# Altium project Booster_USER_IFC_W5500.PrjPcb
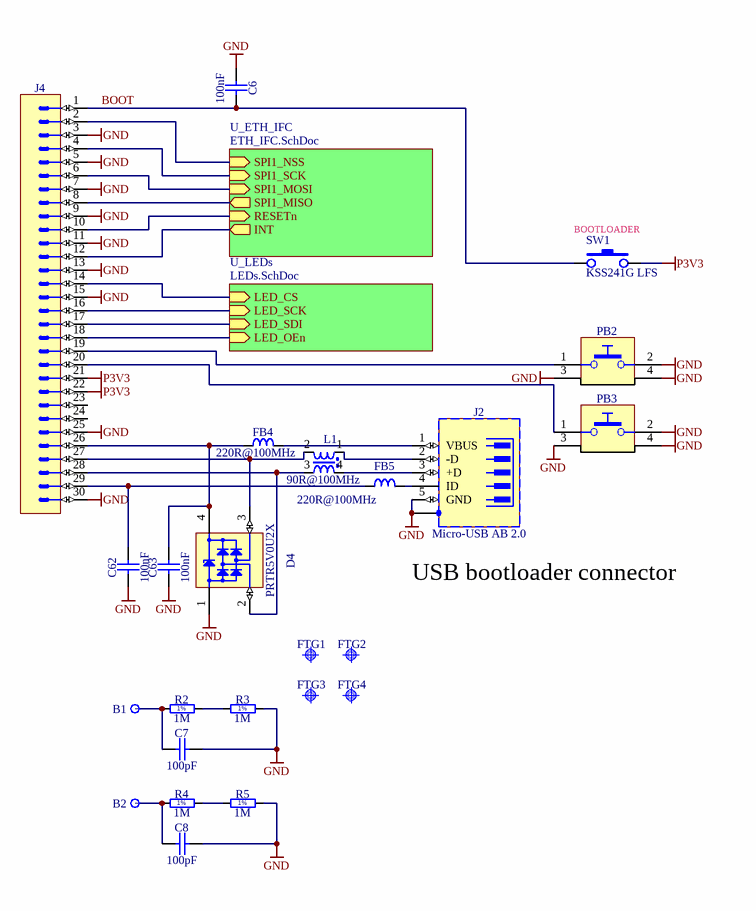
[diagram p0: Booster_USER_IFC_W5500.SchDoc]
rev: 1.6.2
3 sheets, 87 parts. Net scope: hierarchical (ports join the sheet entries above them; power ports are global).
Board file: Booster_USER_IFC_W5500.PcbDoc
Sheets:
  Booster_USER_IFC_W5500.SchDoc
    U_ETH_IFC = ETH_IFC.SchDoc
    U_LEDs = LEDs.SchDoc

## Sheet Booster_USER_IFC_W5500.SchDoc: Booster User Interface
size 420 x 297 mm; Author: G.K.; CompanyName: WUT; DrawnBy: G.K.; Organization: WUT ISE; Address1: Warsaw Univeristy of Technology; Address2: Nowowiejska 15/19; DocumentNumber: 1; Revision: 1.6.2; SheetNumber: 1; SheetTotal: 3; EDA_Number: ARTIQ; Projet: Booster RF Power Amplifier; ModifiedBy: -; CreateDate: XX/XX/XXXX; CheckedDate: -; Title2: TOP; DivGrp: ISE; Designer: G.K.; ModifiedDate: -; ProjectName: Booster RF Power Amplifier

### Parts
B1  Plated Hole  [MTG320_550]  (value not drawn)  (no BOM)
B2  Plated Hole  [MTG320_550]  (value not drawn)  (no BOM)
C6  100nF  [CAPC1005X55N]
C7  100pF  [CAPC2012X88N]
C8  100pF  [CAPC2012X88N]
C62  100nF  [CAPC1005X55N]
C63  100nF  [CAPC1005X55N]
D4  PRTR5V0U2X  [SOT190P230X110-4N]
FB4  220R@100MHz  [INDC2012X105N]
FB5  220R@100MHz  [INDC2012X105N]
FTG1  Use only in PCB  [FIDUCIAL_TOP_C100-200]  (value not drawn)
FTG2  Use only in PCB  [FIDUCIAL_TOP_C100-200]  (value not drawn)
FTG3  Use only in PCB  [FIDUCIAL_TOP_S100-200]  (value not drawn)
FTG4  Use only in PCB  [FIDUCIAL_TOP_S100-200]  (value not drawn)
J2  Micro-USB AB 2.0  [HIROSE_ZX62RD-AB-5P8]
J4  (no value)  [3M_N2530-6002RB]
L1  90R@100MHz  [IND_MURATA_DLW21S]
PB2  Push Button  [PB_TYCO_1-1825027-1]  (value not drawn)
PB3  Push Button  [PB_TYCO_1-1825027-1]  (value not drawn)
R2  1M  [RESC1005X40N]
R3  1M  [RESC1005X40N]
R4  1M  [RESC1005X40N]
R5  1M  [RESC1005X40N]
SW1  KSS241G LFS  [KSS241G LFS]

### Sub-sheets
U_ETH_IFC = ETH_IFC.SchDoc: SPI1_NSS (in), SPI1_SCK (in), SPI1_MOSI (in), SPI1_MISO (out), INT (out), RESETn (in)
U_LEDs = LEDs.SchDoc: LED_CS (in), LED_SCK (in), LED_SDI (in), LED_OEn (in)

### Nets
GND: C6.1 C7.2 C8.2 C62.1 C63.1 D4.1(GND) J2.5(GND) J2.6(SH) J4.3 J4.5 J4.7 J4.9 J4.11 J4.13 J4.15 J4.25 J4.30 PB2.2 PB2.3 PB2.4 PB3.2 PB3.3 PB3.4 R3.2 R5.2
P3V3: J4.21 J4.22 SW1.2
BOOT: C6.2 J4.1 SW1.1
INT: J4.12 ; sheet U_ETH_IFC/INT
LED_CS: J4.14 ; sheet U_LEDs/LED_CS
LED_OEn: J4.18 ; sheet U_LEDs/LED_OEn
LED_SCK: J4.16 ; sheet U_LEDs/LED_SCK
LED_SDI: J4.17 ; sheet U_LEDs/LED_SDI
RESETn: J4.10 ; sheet U_ETH_IFC/RESETn
SPI1_MISO: J4.8 ; sheet U_ETH_IFC/SPI1_MISO
SPI1_MOSI: J4.6 ; sheet U_ETH_IFC/SPI1_MOSI
SPI1_NSS: J4.2 ; sheet U_ETH_IFC/SPI1_NSS
SPI1_SCK: J4.4 ; sheet U_ETH_IFC/SPI1_SCK
NetB1_1: B1.1 C7.1 R2.1
NetB2_1: B2.1 C8.1 R4.1
NetC62_2: C62.2 FB5.1 J4.29
NetC63_2: C63.2 D4.4(VCC) FB4.1 J4.26
NetD4_2: D4.2(I/O1) J4.28 L1.3
NetD4_3: D4.3(I/O2) J4.27 L1.2
NetFB4_2: FB4.2 J2.1(VBUS)
NetFB5_2: FB5.2 J2.4(ID)
NetJ2_2: J2.2(-D) L1.1
NetJ2_3: J2.3(+D) L1.4
NetJ4_19: J4.19 PB2.1
NetJ4_20: J4.20 PB3.1
NetR2_2: R2.2 R3.1
NetR4_2: R4.2 R5.1

Not connected (* = marked no-connect by the designer): J4 23 24

### Notes on the sheet
- (near SW1) BOOTLOADER
- (near J2) USB bootloader connector
- Project/Equipment
- Document
- Designer
- Drawn by
- Check.by
- File
- Last Mod.
- Print Date
- Sheet
- Size
- A3
- of
- Rev
- (in symbol R0402_1M_1%_0.0625W_100PPM) 1%

### Library data of the parts
B1 B2 = PLATED_HOLE3.2_PAD5.5: Single Terminal Socket; Part Description: Plated Through Hole: Hole Dia.=3.2mm Pad Dia.=5.5mm; Mounted: No; Part Number: PLATED_HOLE3.2_PAD5.5; Component Type: Standard (No BOM); Pin Count: 1; Family: Plated Hole; Socket: No; SMD: No; Sense: No; Status: None; ComponentHeight: 0mm; HelpURL: Undefined; Author: CERN DEM JMW; CreateDate: 01.10.2012; LatestRevisionDate: 01.10.2012; PackageDescription: Plated Through Hole: Hole Dia.=3.2mm Pad Dia.=5.5mm
C6 C62 C63 = CC0402_100NF_16V_10%_X7R: Non-polarised capacitor; Part Description: SMD Multilayer Chip Ceramic Capacitor; Manufacturer: GENERIC; Manufacturer1 Part Number: GRM155R71C104KA88D; Voltage: 16V; TC: X7R; Tolerance: ±10%; Part Number: CC0402_100NF_16V_10%_X7R; Component Kind: Standard; Component Type: Standard; Pin Count: 2; Value: 100nF; Status: Not Recommended; Manufacturer Part Number: CC0402_100NF_16V_10%_X7R; Case: 0402; Mounted: Yes; Socket: No; SMD: Yes; Manufacturer1 Example: MURATA; Manufacturer1 ComponentHeight: 0.55mm; HelpURL: \\cern.ch\dfs\Applications\Altium\Datasheets\CC0402_X7R_MURATA_GRM.pdf; Author: CERN DEM JLC; CreateDate: 05.12.2013; LatestRevisionDate: 03.12.2007; Sense: No
C7 C8 = CC0805_100PF_200V_5%_C0G: Non-polarised capacitor; Part Description: SMD Multilayer Chip Ceramic Capacitor; Manufacturer: GENERIC; Manufacturer1 Part Number: C0805C101J2GACTU; Voltage: 200V; TC: C0G/NP0; Tolerance: ±5%; Part Number: CC0805_100PF_200V_5%_C0G; Component Kind: Standard; Component Type: Standard; Pin Count: 2; Value: 100pF; Status: Preferred; Manufacturer Part Number: CC0805_100PF_200V_5%_C0G; Case: 0805; Mounted: Yes; Socket: No; SMD: Yes; Sense: No; Manufacturer1 Example: KEMET; Manufacturer1 ComponentHeight: 0.88mm; HelpURL: \\cern.ch\dfs\Applications\Altium\Datasheets\CC0805_C0G_KEMET_(Commercial Grade).pdf; Author: CERN DEM JLC; CreateDate: 23.09.2014; LatestRevisionDate: 23.09.2014
D4 = PRTR5V0U2X: Ultra Low Capacitance Double Rail-to-Rail ESD Protection Diode; Part Description: Ultra Low Capacitance (1pF) Double Rail-to-Rail ESD Protection Diode (8kV); Manufacturer: NXP SEMICONDUCTORS; Voltage: 5.5V; PressFit: No; Bonding: No; Part Number: PRTR5V0U2X; Component Kind: Standard; Component Type: Standard; Device: PRTR5V0U2X; PackageDescription: SOT143B, SOT, 1.90mm Pitch; 4 Pin, 1.30mm W X 2.90mm L X 1.10mm H body, IPC Medium Density; Manufacturer Part Number: PRTR5V0U2X; Pin Count: 4; Case: SOT143B; Mounted: Yes; Socket: No; SMD: Yes; Sense: No; ComponentHeight: 1.1mm; HelpURL: \\cern.ch\dfs\Applications\Altium\Datasheets\PRTR5V0U2X.pdf; Author: CERN DEM JLC; CreateDate: 22.03.2011; LatestRevisionDate: 22.03.2011
FB4 FB5 = IND0805_MURATA_BLM21PG221SN1D: Inductor; Part Description: SMD EMIFIL Suppression Chip Ferrite Bead; Manufacturer: MURATA; Power: 2A; Resistance: 0.05R; Tolerance: ±25%; Table: Inductors SMD; Part Number: IND0805_MURATA_BLM21PG221SN1D; Component Kind: Standard; Component Type: Standard; Pin Count: 2; Value: 220R@100MHz; Status: None; Manufacturer Part Number: BLM21PG221SN1D; Case: 0805; Mounted: Yes; Socket: No; SMD: Yes; ComponentHeight: 1.05mm; HelpURL: \\cern.ch\dfs\Applications\Altium\Datasheets\IND0402_MURATA_BLM21P.pdf; Author: CERN DEM JLC; CreateDate: 2010-01-25; LatestRevisionDate: 2010-01-25
FTG1 FTG2 = FIDUCIAL_TARGET_C100-200: Fiducial Target; Part Description: Round Fiducial Target, Top Layer, 1.0mm, Top Solder 2.0mm, Keepout =2.0mm; Mounted: No; Part Number: FIDUCIAL_TARGET_C100-200; Component Kind: Standard (No BOM); Component Type: Standard (No BOM); Pin Count: 1; Family: Fiducial; Socket: No; SMD: Yes; Sense: No; Status: None; ComponentHeight: 0mm; HelpURL: Undefined; Author: CERN DEM JLC; CreateDate: 09.02.2010; LatestRevisionDate: 04.04.2012; PackageDescription: Round Fiducial Target, Top Layer, 1.0mm, Top Solder 2.0mm, Keepout =2.0mm
FTG3 FTG4 = FIDUCIAL_TARGET_S100-200: Fiducial Target; Part Description: Square Fiducial Target, Top Layer, 1.0mm, Top Solder 2.0mm, Keepout =2.0mm; Mounted: No; Part Number: FIDUCIAL_TARGET_S100-200; Component Kind: Standard (No BOM); Component Type: Standard (No BOM); Pin Count: 1; Family: Fiducial; Socket: No; SMD: Yes; Sense: No; Status: None; ComponentHeight: 0mm; HelpURL: Undefined; Author: CERN DEM JLC; CreateDate: 09.02.2010; LatestRevisionDate: 04.04.2012; PackageDescription: Square Fiducial Target, Top Layer, 1.0mm, Top Solder 2.0mm, Keepout =2.0mm
J2 = HIROSE_ZX62RD-AB-5P8: 5 Pin + 1 Shield USB Receptacle; Part Description: Micro-USB 2.0 Right Angle, SMD Type AB - Reverse (Top mount), Shell Through Hole; Manufacturer: HIROSE (HRS); PressFit: No; Part Number: HIROSE_ZX62RD-AB-5P8; Component Kind: Standard; Component Type: Standard; Pin Count: 7; Family: Micro-USB AB 2.0; Mounted: Yes; Socket: No; SMD: Yes; Sense: No; Status: None; Manufacturer Part Number: ZX62RD-AB-5P8; ComponentHeight: 2.35mm; HelpURL: \\cern.ch\dfs\Applications\Altium\Datasheets\HIROSE_ZX62RD-AB-5P8.pdf; ComponentLink1URL: \\cern.ch\dfs\Applications\Altium\Datasheets\HIROSE_ZX62RD-AB-5P8_Package-Drawing.pdf; ComponentLink1Description: Package-Drawing; Author: CERN DEM JLC; CreateDate: 29.10.2014; LatestRevisionDate: 29.10.2014
J4 = 3M_N2530-6002RB: Connector 30 Male; Part Description: 30 Contacts - Straight .100'' x .100'' Low Profile Four-Wall Header, 2500 Series; Manufacturer: 3M; PressFit: No; Part Number: 3M_N2530-6002RB; Component Kind: Standard; Component Type: Standard; Pin Count: 30; Family: Header 30; Mounted: Yes; Socket: No; SMD: No; Sense: No; Status: None; Manufacturer Part Number: N2530-6002RB; ComponentHeight: 10.03mm; HelpURL: \\cern.ch\dfs\Applications\Altium\Datasheets\3M_N2530-6002RB.pdf; Author: CERN DEM JLC; CreateDate: 11.02.2009; LatestRevisionDate: 11.08.2009
L1 = IND_MURATA_DLW21SN900SQ2L: Inductor Common Mode; Part Description: Wire Wound Common Mode Choke Coil (DLW21S Series); Manufacturer: MURATA; Power: 330mA; Resistance: 0.35R; Tolerance: ±25%; Part Number: IND_MURATA_DLW21SN900SQ2L; Component Kind: Standard; Component Type: Standard; Pin Count: 4; Value: 90R@100MHz; Status: None; Manufacturer Part Number: DLW21SN900SQ2L; Case: 0805; Mounted: Yes; Socket: No; SMD: Yes; Sense: No; ComponentHeight: 1.4mm; HelpURL: \\cern.ch\dfs\Applications\Altium\Datasheets\IND_MURATA_DLW21S.pdf; Author: CERN DEM JLC; CreateDate: 01.07.2014; LatestRevisionDate: 01.07.2014
PB2 PB3 = PB_TYCO_1-1825027-1: Push-Button Switch SPDT; Part Description: Right Angle Micro Miniature Tactile Pushbutton Switch, Round Actuator Length = 5.74mm, FSMRAJ Serie; Manufacturer: TYCO ELECTRONICS; PressFit: No; Part Number: PB_TYCO_1-1825027-1; Component Kind: Standard; Component Type: Standard; Pin Count: 4; PackageDescription: Right Angle Micro Miniature Tactile Pushbutton Switch, Round Actuator Length = 5.74mm, FSMRAJ Serie; Family: Push Button; Mounted: Yes; Socket: No; SMD: No; Sense: No; Status: None; Manufacturer Part Number: 1-1825027-1; ComponentHeight: 7.01mm; HelpURL: \\cern.ch\dfs\Applications\Altium\Datasheets\PB_TYCO_1-1825027-1.pdf; Author: CERN DEM JLC; CreateDate: 17.04.2013; LatestRevisionDate: 28.10.2013
R2-R5 = R0402_1M_1%_0.0625W_100PPM: Resistor - 1%; Part Description: General Purpose Thick Film Chip Resistor; Manufacturer: GENERIC; Manufacturer1 Part Number: 232270671005L; TC: ±100ppm/°C; Part Number: R0402_1M_1%_0.0625W_100PPM; Component Kind: Standard; Component Type: Standard; Pin Count: 2; Value: 1M; Status: Not recommended; Power: 0.0625W; Tolerance: ±1%; Manufacturer Part Number: R0402_1M_1%_0.0625W_100PPM; Case: 0402; Mounted: Yes; Sense: No; Socket: No; SMD: Yes; Manufacturer1 Example: YAGEO PHYCOMP; Manufacturer1 ComponentHeight: 0.4mm; HelpURL: \\cern.ch\dfs\Applications\Altium\Datasheets\R0402_Phycomp_RC0402.pdf; Author: CERN DEM JLC; CreateDate: 03.12.2007; LatestRevisionDate: 17.10.2012
SW1 = SW-TACT_SMD_RA_mini: Push button; Supplier 1: Farnell; Supplier Part Number 1: 1437640; Manufacturer Part Number: KSS241G LFS

## Sheet ETH_IFC.SchDoc: Ethernet Interface
size 420 x 297 mm; Author: G.K.; CompanyName: WUT; DrawnBy: G.K.; Organization: WUT ISE; Address1: Warsaw Univeristy of Technology; Address2: Nowowiejska 15/19; DocumentNumber: 2; Revision: 1.6.2; SheetNumber: 2; SheetTotal: 3; EDA_Number: ARTIQ; Projet: Booster RF Power Amplifier; ModifiedBy: -; CreateDate: XX/XX/XXXX; CheckedDate: -; Title2: TCP/IP stack + MAC + PHY; DivGrp: ISE; Designer: G.K.; ModifiedDate: -; ProjectName: Booster RF Power Amplifier
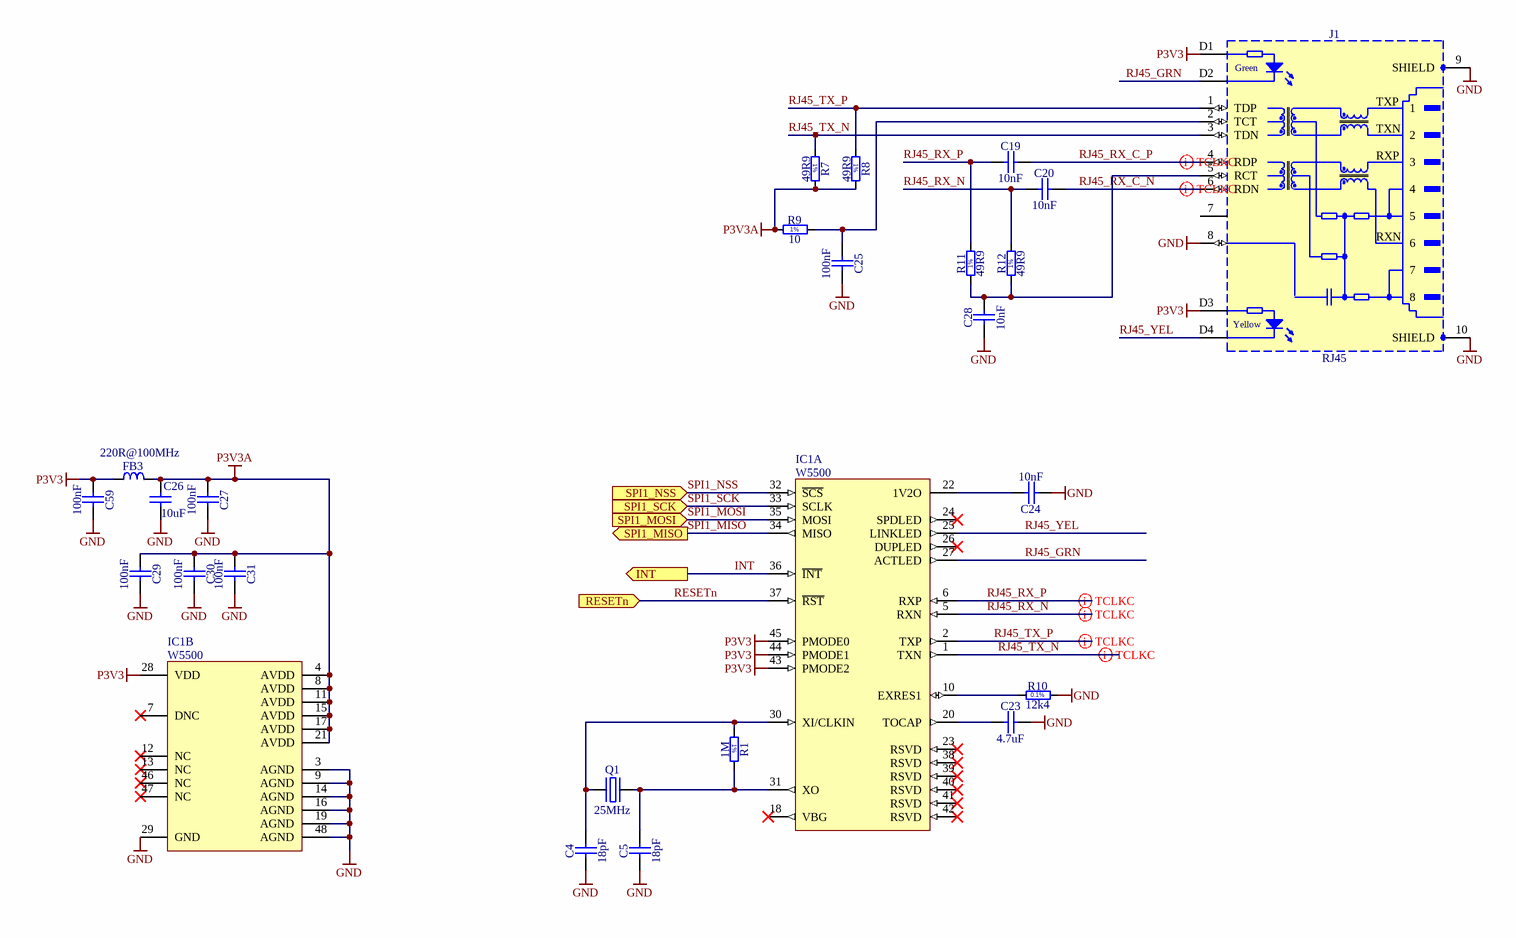
[diagram p1: ETH_IFC.SchDoc]

### Parts
C4  18pF  [CAPC1005X55N]
C5  18pF  [CAPC1005X55N]
C19  10nF  [CAPC1608X87N]
C20  10nF  [CAPC1608X87N]
C23  4.7uF  [CAPC1709X95N]
C24  10nF  [CAPC1608X87N]
C25  100nF  [CAPC1005X55N]
C26  10uF  [CAPC2012X135N]
C27  100nF  [CAPC1005X55N]
C28  10nF  [CAPC1608X87N]
C29  100nF  [CAPC1005X55N]
C30  100nF  [CAPC1005X55N]
C31  100nF  [CAPC1005X55N]
C59  100nF  [CAPC1005X55N]
FB3  220R@100MHz  [INDC2012X105N]
IC1  W5500  [QFP50P900X900X160-48N]  (parts A,B of 2)
J1  RJ45  [TYCO_5-6605308-1]
Q1  25MHz  [XTAL_TXC_AA]
R1  1M  [RESC1005X40N]
R7  49R9  [RESC1005X40N]
R8  49R9  [RESC1005X40N]
R9  10  [RESC1005X40N]
R10  12k4  [RESC1608X55N]
R11  49R9  [RESC1005X40N]
R12  49R9  [RESC1005X40N]

### Ports
INT (out), RESETn (in), SPI1_MISO (out), SPI1_MOSI (in), SPI1_NSS (in), SPI1_SCK (in)

### Nets
GND: C4.1 C5.1 C23.2 C24.1 C25.2 C26.2 C27.2 C28.1 C29.2 C30.2 C31.2 C59.2 IC1.3(AGND) IC1.9(AGND) IC1.14(AGND) IC1.16(AGND) IC1.19(AGND) IC1.29(GND) IC1.48(AGND) J1.8 J1.9(SHIELD) J1.10(SHIELD) R10.2
P3V3: C59.1 FB3.1 IC1.28(VDD) IC1.43(PMODE2) IC1.44(PMODE1) IC1.45(PMODE0) J1.D1 J1.D3
P3V3A: C26.1 C27.1 C29.1 C30.1 C31.1 FB3.2 IC1.4(AVDD) IC1.8(AVDD) IC1.11(AVDD) IC1.15(AVDD) IC1.17(AVDD) IC1.21(AVDD) R7.2 R8.2 R9.1
INT: IC1.36(~{INT}) ; port INT
RESETn: IC1.37(~{RST}) ; port RESETn
RJ45_GRN: IC1.27(ACTLED) J1.D2
RJ45_RX_C_N: C20.2 J1.6(RDN)
RJ45_RX_C_P: C19.2 J1.4(RDP)
RJ45_RX_N: C20.1 IC1.5(RXN) R12.2
RJ45_RX_P: C19.1 IC1.6(RXP) R11.2
RJ45_TX_N: IC1.1(TXN) J1.3(TDN) R7.1
RJ45_TX_P: IC1.2(TXP) J1.1(TDP) R8.1
RJ45_YEL: IC1.25(LINKLED) J1.D4
SPI1_MISO: IC1.34(MISO) ; port SPI1_MISO
SPI1_MOSI: IC1.35(MOSI) ; port SPI1_MOSI
SPI1_NSS: IC1.32(~{SCS}) ; port SPI1_NSS
SPI1_SCK: IC1.33(SCLK) ; port SPI1_SCK
NetC4_2: C4.2 IC1.30(XI/CLKIN) Q1.1(OSC1) R1.1
NetC5_2: C5.2 IC1.31(XO) Q1.2(OSC2) R1.2
NetC23_1: C23.1 IC1.20(TOCAP)
NetC24_2: C24.2 IC1.22(1V2O)
NetC25_1: C25.1 J1.2(TCT) R9.2
NetC28_2: C28.2 J1.5(RCT) R11.1 R12.1
NetIC1_10: IC1.10(EXRES1) R10.1

Not connected (* = marked no-connect by the designer): IC1 7(DNC)* 12(NC)* 13(NC)* 18(VBG)* 23(RSVD)* 24(SPDLED)* 26(DUPLED)* 38(RSVD)* 39(RSVD)* 40(RSVD)* 41(RSVD)* 42(RSVD)* 46(NC)* 47(NC)*; J1 7

### Layout directives
differential pair: RJ45_RX_C_N, RJ45_RX_C_P, RJ45_RX_N, RJ45_RX_P, RJ45_TX_N, RJ45_TX_P

### Notes on the sheet
- Project/Equipment
- Document
- Designer
- Drawn by
- Check.by
- File
- Last Mod.
- Print Date
- Sheet
- Size
- A3
- of
- Rev
- (in symbol R0402_1M_1%_0.0625W_100PPM) 1%
- (in symbol R0402_10R_1%_0.0625W_200PPM) 1%
- (in symbol R0402_49R9_1%_0.0625W_100PPM) 1%
- (in symbol R0603_12K4_0.1%_0.063W_10PPM) 0.1%
- (in symbol TYCO_5-6605308-1) Green; TXP; TXN; RXP; RXN; Yellow

### Library data of the parts
C4 C5 = CC0402_18PF_50V_5%_C0G: Non-polarised capacitor; Part Description: SMD Multilayer Chip Ceramic Capacitor; Manufacturer: GENERIC; Manufacturer1 Part Number: C0402C180J5GACTU; Voltage: 50V; TC: C0G/NP0; Tolerance: ±5%; Part Number: CC0402_18PF_50V_5%_C0G; Component Kind: Standard; Component Type: Standard; Pin Count: 2; Value: 18pF; Status: Preferred; Manufacturer Part Number: CC0402_18PF_50V_5%_C0G; Case: 0402; Mounted: Yes; Socket: No; SMD: Yes; Manufacturer1 Example: KEMET; Manufacturer1 ComponentHeight: 0.55mm; HelpURL: \\cern.ch\dfs\Applications\Altium\Datasheets\CC0402_C0G_KEMET_(Commercial Grade).pdf; Author: CERN DEM JLC; CreateDate: 04.10.2016; LatestRevisionDate: 04.10.2016; Sense: No
C19 C20 C24 C28 = CC0603_10NF_50V_5%_C0G: Non-polarised capacitor; Part Description: SMD Multilayer Chip Ceramic Capacitor; Manufacturer: GENERIC; Manufacturer1 Part Number: C1608C0G1H103J080AA; Voltage: 50V; TC: C0G/NP0; Tolerance: ±5%; Part Number: CC0603_10NF_50V_5%_C0G; Component Kind: Standard; Component Type: Standard; Pin Count: 2; Value: 10nF; Status: Preferred; Manufacturer Part Number: CC0603_10NF_50V_5%_C0G; Case: 0603; Mounted: Yes; Socket: No; SMD: Yes; Sense: No; Manufacturer1 Example: TDK; Manufacturer1 ComponentHeight: 0.9mm; HelpURL: \\cern.ch\dfs\Applications\Altium\Datasheets\CC0603_C0G_TDK_C.pdf; Author: CERN DEM JLC; CreateDate: 10.12.2014; LatestRevisionDate: 10.12.2014
C23 = CC0603_4.7UF_16V_10%_X5R: Non-polarised capacitor; Part Description: SMD Multilayer Chip Ceramic Capacitor; Manufacturer: GENERIC; Manufacturer1 Part Number: EMK107ABJ475KA-T; Voltage: 16V; TC: X5R; Tolerance: ±10%; Part Number: CC0603_4.7UF_16V_10%_X5R; Component Kind: Standard; Component Type: Standard; Pin Count: 2; Value: 4.7uF; Status: None; Manufacturer Part Number: CC0603_4.7UF_16V_10%_X5R; Case: 0603; Mounted: Yes; Socket: No; SMD: Yes; Sense: No; Manufacturer1 Example: TAIYO YUDEN; Manufacturer1 ComponentHeight: 0.95mm; HelpURL: \\cern.ch\dfs\Applications\Altium\Datasheets\CC0603_X7R_TAIYO-YUDEN_HIGH-VALUE.pdf; Author: CERN DEM JLC; CreateDate: 16.12.2013; LatestRevisionDate: 16.09.2014
C25 C27 C29-C31 C59 = CC0402_100NF_16V_10%_X7R: as C6 on sheet Booster_USER_IFC_W5500; Part Number: CC0402_100NF_16V_10%_X7R; Component Kind: Standard; Component Type: Standard; Pin Count: 2; Value: 100nF; Status: Not Recommended; Manufacturer Part Number: CC0402_100NF_16V_10%_X7R; Case: 0402; Mounted: Yes; Socket: No; SMD: Yes; Manufacturer1 Example: MURATA; Manufacturer1 ComponentHeight: 0.55mm; HelpURL: \\cern.ch\dfs\Applications\Altium\Datasheets\CC0402_X7R_MURATA_GRM.pdf; Author: CERN DEM JLC; CreateDate: 05.12.2013; LatestRevisionDate: 03.12.2007; Sense: No
C26 = CC0805_10UF_10V_10%_X7R: Non-polarised capacitor; Part Description: SMD Multilayer Chip Ceramic Capacitor; Manufacturer: GENERIC; Manufacturer1 Part Number: GRM21BR71A106KE51L; Voltage: 10V; TC: X7R; Tolerance: ±10%; Table: Capacitors SMD; Part Number: CC0805_10UF_10V_10%_X7R; Component Kind: Standard; Component Type: Standard; Pin Count: 2; Value: 10uF; Status: Preferred; Manufacturer Part Number: CC0805_10UF_10V_10%_X7R; Case: 0805; Mounted: Yes; Socket: No; SMD: Yes; Manufacturer1 Example: MURATA; Manufacturer1 ComponentHeight: 1.35mm; HelpURL: \\cern.ch\dfs\Applications\Altium\Datasheets\CC0805_X7R_MURATA.pdf; Author: CERN DEM JLC; CreateDate: 2012-04-30; LatestRevisionDate: 2012-04-30
FB3 = IND0805_MURATA_BLM21PG221SN1D: as FB4 on sheet Booster_USER_IFC_W5500; Part Number: IND0805_MURATA_BLM21PG221SN1D; Component Kind: Standard; Component Type: Standard; Pin Count: 2; Value: 220R@100MHz; Status: None; Manufacturer Part Number: BLM21PG221SN1D; Case: 0805; Mounted: Yes; Socket: No; SMD: Yes; ComponentHeight: 1.05mm; HelpURL: \\cern.ch\dfs\Applications\Altium\Datasheets\IND0402_MURATA_BLM21P.pdf; Author: CERN DEM JLC; CreateDate: 2010-01-25; LatestRevisionDate: 2010-01-25
IC1 = W5500: iEthernet W5500 TCP/IP Performance and High Speed SPI Ethernet Controller; Manufacturer: WIZNET; PressFit: No; Bonding: No; Part Number: W5500; Component Kind: Standard; Component Type: Standard; Device: W5500; PackageDescription: QFP, 0.50mm Pitch, Square, 48 Pin, 7.00mm L X 7.00mm W X 1.60mm H Body, IPC Medium Density; Part Description: iEthernet W5500 TCP/IP Performance and High Speed SPI Ethernet Controller; Manufacturer Part Number: W5500; Pin Count: 48; Case: QFP48; Mounted: Yes; Socket: No; SMD: Yes; Sense: No; ComponentHeight: 1.6mm; Author: CERN DEM MR; HelpURL: \\cern.ch\dfs\Applications\Altium\Datasheets\W5500.pdf; CreateDate: 15.02.2018; LatestRevisionDate: 15.02.2018
J1 = TYCO_5-6605308-1: 1 Port, Yellow/Green LEDs, RJ45 10/100Base-T Ethernet, Mag45 Connector Module With Integrated Magnetics; Manufacturer: TYCO ELECTRONICS; PressFit: No; Part Number: TYCO_5-6605308-1; Component Kind: Standard; Component Type: Standard; Pin Count: 14; Family: RJ45; Mounted: Yes; Socket: No; SMD: No; Sense: No; Status: None; Part Description: 1 Port, Yellow/Green LEDs, RJ45 10/100Base-T Ethernet, Mag45 Connector Module With Integrated Magnetics; Manufacturer Part Number: 5-6605308-1; ComponentHeight: 15.24mm; HelpURL: \\cern.ch\dfs\Applications\Altium\Datasheets\TYCO_5-6605308-1.pdf; Author: CERN DEM JLC; CreateDate: 23.08.2012; LatestRevisionDate: 23.08.2012
Q1 = XTAL_25MHZ_TXC_AA-25.000MALE-T: Quartz Crystal; Part Description: Tolerance: ± 30ppm, Stability: ±50ppm, -40°C to +85°C, 8pF, SMD Glass Sealing Crystal, AA Series; Manufacturer: TXC CORPORATION; PressFit: No; Bonding: No; Part Number: XTAL_25MHZ_TXC_AA-25.000MALE-T; Component Kind: Standard; Component Type: Standard; PackageDescription: SMD Glass Seam Sealing Crystal, 2 Pins, 3.20mm L X 5.00mm W, AA Serie; Value: 25MHz; Manufacturer Part Number: AA-25.000MALE-T; Pin Count: 2; Mounted: Yes; Socket: No; SMD: Yes; Sense: No; ComponentHeight: 1.2mm; HelpURL: \\cern.ch\dfs\Applications\Altium\Datasheets\XTAL_TXC_AA.pdf; Author: GK; CreateDate: 28.08.2018; LatestRevisionDate: 28.08.2018
R1 = R0402_1M_1%_0.0625W_100PPM: as R2 on sheet Booster_USER_IFC_W5500; Part Number: R0402_1M_1%_0.0625W_100PPM; Component Kind: Standard; Component Type: Standard; Pin Count: 2; Value: 1M; Status: Not recommended; Power: 0.0625W; Tolerance: ±1%; Manufacturer Part Number: R0402_1M_1%_0.0625W_100PPM; Case: 0402; Mounted: Yes; Sense: No; Socket: No; SMD: Yes; Manufacturer1 Example: YAGEO PHYCOMP; Manufacturer1 ComponentHeight: 0.4mm; HelpURL: \\cern.ch\dfs\Applications\Altium\Datasheets\R0402_Phycomp_RC0402.pdf; Author: CERN DEM JLC; CreateDate: 03.12.2007; LatestRevisionDate: 17.10.2012
R7 R8 R11 R12 = R0402_49R9_1%_0.0625W_100PPM: Resistor - 1%; Part Description: General Purpose Thick Film Chip Resistor; Manufacturer: GENERIC; Manufacturer1 Part Number: 232270674999L or RC0402FR-0749R9L; TC: ±100ppm/°C; Table: Resistors SMD; Part Number: R0402_49R9_1%_0.0625W_100PPM; Component Kind: Standard; Component Type: Standard; Pin Count: 2; Value: 49R9; Status: Not recommended; Power: 0.0625W; Tolerance: ±1%; Manufacturer Part Number: R0402_49R9_1%_0.0625W_100PPM; Case: 0402; Mounted: Yes; Socket: No; SMD: Yes; Manufacturer1 Example: YAGEO PHYCOMP; Manufacturer1 ComponentHeight: 0.4mm; HelpURL: \\cern.ch\dfs\Applications\Altium\Datasheets\R0402_Phycomp_RC0402.pdf; Author: CERN DEM JLC; CreateDate: 2012-10-24; LatestRevisionDate: 2012-10-24
R9 = R0402_10R_1%_0.0625W_200PPM: Resistor - 1%; Part Description: General Purpose Thick Film Chip Resistor; Manufacturer: GENERIC; Manufacturer1 Part Number: 232270671009L; TC: ±200ppm/°C; Part Number: R0402_10R_1%_0.0625W_200PPM; Component Kind: Standard; Component Type: Standard; Pin Count: 2; Value: 10; Status: Not recommended; Power: 0.0625W; Tolerance: ±1%; Manufacturer Part Number: R0402_10R_1%_0.0625W_200PPM; Case: 0402; Mounted: Yes; Sense: No; Socket: No; SMD: Yes; Manufacturer1 Example: YAGEO PHYCOMP; Manufacturer1 ComponentHeight: 0.4mm; HelpURL: \\cern.ch\dfs\Applications\Altium\Datasheets\R0402_Phycomp_RC0402.pdf; Author: CERN DEM JLC; CreateDate: 24.06.2009; LatestRevisionDate: 17.10.2012
R10 = R0603_12K4_0.1%_0.063W_10PPM: Resistor - 0.1%; Part Description: Thin Film Chip Resistor; Manufacturer: GENERIC; Manufacturer1 Part Number: RN73C1J12K4BTDF; Power: 0.063W; TC: ±10ppm; Part Number: R0603_12K4_0.1%_0.063W_10PPM; Component Kind: Standard; Component Type: Standard; Pin Count: 2; Value: 12k4; Status: Not recommended; Tolerance: ±0.1%; Manufacturer Part Number: R0603_12K4_0.1%_0.063W_10PPM; Case: 0603; Mounted: Yes; Sense: No; Socket: No; SMD: Yes; Manufacturer1 Example: TYCO HOLSWORTHY; Manufacturer1 ComponentHeight: 0.5mm; HelpURL: \\cern.ch\dfs\Applications\Altium\Datasheets\R0603_Tyco_RN73.pdf; Author: CERN DEM JLC; CreateDate: 03.12.2007; LatestRevisionDate: 13.03.2008

## Sheet LEDs.SchDoc: front panel LEDs
size 420 x 297 mm; Author: G.K.; CompanyName: WUT; DrawnBy: G.K.; Organization: WUT ISE; Address1: Warsaw Univeristy of Technology; Address2: Nowowiejska 15/19; DocumentNumber: 3; Revision: 1.6.2; SheetNumber: 3; SheetTotal: 3; EDA_Number: ARTIQ; Projet: Booster RF Power Amplifier; ModifiedBy: -; CreateDate: XX/XX/XXXX; CheckedDate: -; Title2: & registers; DivGrp: ISE; Designer: G.K.; ModifiedDate: -; ProjectName: Booster RF Power Amplifier
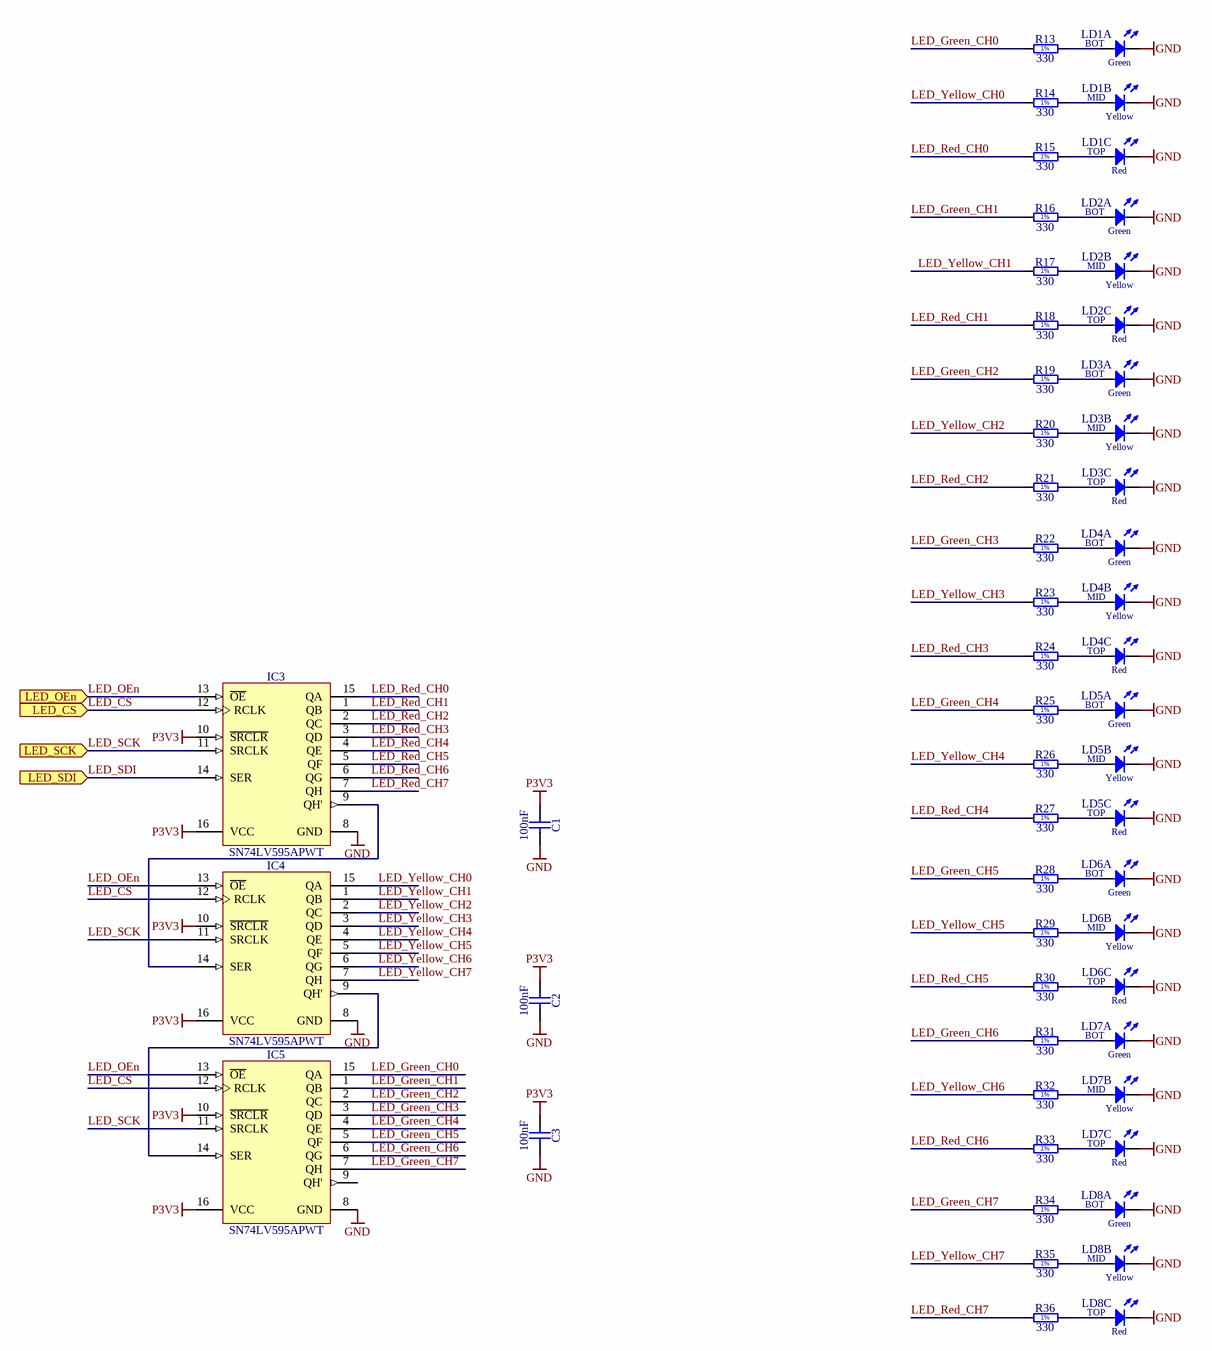
[diagram p2: LEDs.SchDoc]

### Parts
C1  100nF  [CAPC1005X55N]
C2  100nF  [CAPC1005X55N]
C3  100nF  [CAPC1005X55N]
IC3  SN74LV595APWT  [SOP65P640X120-16N]
IC4  SN74LV595APWT  [SOP65P640X120-16N]
IC5  SN74LV595APWT  [SOP65P640X120-16N]
LD1  Red/Yellow/Green  [LED_MENTOR_1882.2781]  (value not drawn)  (parts A,B,C of 3)
LD2  Red/Yellow/Green  [LED_MENTOR_1882.2781]  (value not drawn)  (parts A,B,C of 3)
LD3  Red/Yellow/Green  [LED_MENTOR_1882.2781]  (value not drawn)  (parts A,B,C of 3)
LD4  Red/Yellow/Green  [LED_MENTOR_1882.2781]  (value not drawn)  (parts A,B,C of 3)
LD5  Red/Yellow/Green  [LED_MENTOR_1882.2781]  (value not drawn)  (parts A,B,C of 3)
LD6  Red/Yellow/Green  [LED_MENTOR_1882.2781]  (value not drawn)  (parts A,B,C of 3)
LD7  Red/Yellow/Green  [LED_MENTOR_1882.2781]  (value not drawn)  (parts A,B,C of 3)
LD8  Red/Yellow/Green  [LED_MENTOR_1882.2781]  (value not drawn)  (parts A,B,C of 3)
R13  330  [RESC1608X55N]
R14  330  [RESC1608X55N]
R15  330  [RESC1608X55N]
R16  330  [RESC1608X55N]
R17  330  [RESC1608X55N]
R18  330  [RESC1608X55N]
R19  330  [RESC1608X55N]
R20  330  [RESC1608X55N]
R21  330  [RESC1608X55N]
R22  330  [RESC1608X55N]
R23  330  [RESC1608X55N]
R24  330  [RESC1608X55N]
R25  330  [RESC1608X55N]
R26  330  [RESC1608X55N]
R27  330  [RESC1608X55N]
R28  330  [RESC1608X55N]
R29  330  [RESC1608X55N]
R30  330  [RESC1608X55N]
R31  330  [RESC1608X55N]
R32  330  [RESC1608X55N]
R33  330  [RESC1608X55N]
R34  330  [RESC1608X55N]
R35  330  [RESC1608X55N]
R36  330  [RESC1608X55N]

### Ports
LED_CS (in), LED_OEn (in), LED_SCK (in), LED_SDI (in)

### Nets
GND: C1.2 C2.2 C3.2 IC3.8(GND) IC4.8(GND) IC5.8(GND) LD1.1(C) LD1.3(C) LD1.5(C) LD2.1(C) LD2.3(C) LD2.5(C) LD3.1(C) LD3.3(C) LD3.5(C) LD4.1(C) LD4.3(C) LD4.5(C) LD5.1(C) LD5.3(C) LD5.5(C) LD6.1(C) LD6.3(C) LD6.5(C) LD7.1(C) LD7.3(C) LD7.5(C) LD8.1(C) LD8.3(C) LD8.5(C)
P3V3: C1.1 C2.1 C3.1 IC3.10(~{SRCLR}) IC3.16(VCC) IC4.10(~{SRCLR}) IC4.16(VCC) IC5.10(~{SRCLR}) IC5.16(VCC)
LED_CS: IC3.12(RCLK) IC4.12(RCLK) IC5.12(RCLK) ; port LED_CS
LED_Green_CH0: IC5.15(QA) R13.1
LED_Green_CH1: IC5.1(QB) R16.1
LED_Green_CH2: IC5.2(QC) R19.1
LED_Green_CH3: IC5.3(QD) R22.1
LED_Green_CH4: IC5.4(QE) R25.1
LED_Green_CH5: IC5.5(QF) R28.1
LED_Green_CH6: IC5.6(QG) R31.1
LED_Green_CH7: IC5.7(QH) R34.1
LED_OEn: IC3.13(~{OE}) IC4.13(~{OE}) IC5.13(~{OE}) ; port LED_OEn
LED_Red_CH0: IC3.15(QA) R15.1
LED_Red_CH1: IC3.1(QB) R18.1
LED_Red_CH2: IC3.2(QC) R21.1
LED_Red_CH3: IC3.3(QD) R24.1
LED_Red_CH4: IC3.4(QE) R27.1
LED_Red_CH5: IC3.5(QF) R30.1
LED_Red_CH6: IC3.6(QG) R33.1
LED_Red_CH7: IC3.7(QH) R36.1
LED_SCK: IC3.11(SRCLK) IC4.11(SRCLK) IC5.11(SRCLK) ; port LED_SCK
LED_SDI: IC3.14(SER) ; port LED_SDI
LED_Yellow_CH0: IC4.15(QA) R14.1
LED_Yellow_CH1: IC4.1(QB) R17.1
LED_Yellow_CH2: IC4.2(QC) R20.1
LED_Yellow_CH3: IC4.3(QD) R23.1
LED_Yellow_CH4: IC4.4(QE) R26.1
LED_Yellow_CH5: IC4.5(QF) R29.1
LED_Yellow_CH6: IC4.6(QG) R32.1
LED_Yellow_CH7: IC4.7(QH) R35.1
NetIC3_9: IC3.9(QH') IC4.14(SER)
NetIC4_9: IC4.9(QH') IC5.14(SER)
NetLD1_2: LD1.2(A) R13.2
NetLD1_4: LD1.4(A) R14.2
NetLD1_6: LD1.6(A) R15.2
NetLD2_2: LD2.2(A) R16.2
NetLD2_4: LD2.4(A) R17.2
NetLD2_6: LD2.6(A) R18.2
NetLD3_2: LD3.2(A) R19.2
NetLD3_4: LD3.4(A) R20.2
NetLD3_6: LD3.6(A) R21.2
NetLD4_2: LD4.2(A) R22.2
NetLD4_4: LD4.4(A) R23.2
NetLD4_6: LD4.6(A) R24.2
NetLD5_2: LD5.2(A) R25.2
NetLD5_4: LD5.4(A) R26.2
NetLD5_6: LD5.6(A) R27.2
NetLD6_2: LD6.2(A) R28.2
NetLD6_4: LD6.4(A) R29.2
NetLD6_6: LD6.6(A) R30.2
NetLD7_2: LD7.2(A) R31.2
NetLD7_4: LD7.4(A) R32.2
NetLD7_6: LD7.6(A) R33.2
NetLD8_2: LD8.2(A) R34.2
NetLD8_4: LD8.4(A) R35.2
NetLD8_6: LD8.6(A) R36.2

Not connected (* = marked no-connect by the designer): IC5 9(QH')

### Notes on the sheet
- Project/Equipment
- Document
- Designer
- Drawn by
- Check.by
- File
- Last Mod.
- Print Date
- Sheet
- Size
- A3
- of
- Rev
- (in symbol LED_MENTOR_1882.2781, part A) BOT; Green
- (in symbol LED_MENTOR_1882.2781, part B) MID; Yellow
- (in symbol LED_MENTOR_1882.2781, part C) TOP; Red
- (in symbol R0603_330R_1%_0.1W_100PPM) 1%

### Library data of the parts
C1-C3 = CC0402_100NF_16V_10%_X7R: as C6 on sheet Booster_USER_IFC_W5500; Part Number: CC0402_100NF_16V_10%_X7R; Component Kind: Standard; Component Type: Standard; Pin Count: 2; Value: 100nF; Status: Not Recommended; Manufacturer Part Number: CC0402_100NF_16V_10%_X7R; Case: 0402; Mounted: Yes; Socket: No; SMD: Yes; Manufacturer1 Example: MURATA; Manufacturer1 ComponentHeight: 0.55mm; HelpURL: \\cern.ch\dfs\Applications\Altium\Datasheets\CC0402_X7R_MURATA_GRM.pdf; Author: CERN DEM JLC; CreateDate: 05.12.2013; LatestRevisionDate: 03.12.2007; Sense: No
IC3-IC5 = SN74LV595APWT: 8-Bit Shift Register With 3-State Output Register; Manufacturer: TEXAS INSTRUMENTS; PressFit: No; Bonding: No; Part Number: SN74LV595APWT; Component Kind: Standard; Component Type: Standard; Device: SN74LV595APWT; PackageDescription: SOP, 0.65mm pitch; 16 pin, 4.40mm W X 5.00mm L X 1.20mm H body IPC Medium Density; Part Description: 8-Bit Shift Register With 3-State Output Register; Manufacturer Part Number: SN74LV595APWT; Pin Count: 16; Case: TSSOP16; Mounted: Yes; Socket: No; SMD: Yes; Sense: No; ComponentHeight: 1.2mm; Author: CERN DEM JLC; HelpURL: \\cern.ch\dfs\Applications\Altium\Datasheets\SN74LV595APWT.pdf; CreateDate: 10.05.2012; LatestRevisionDate: 10.05.2012
LD1-LD8 = LED_MENTOR_1882.2781: LED x3 G-1C2A-BOT_Y-3C4A_R-5C6A-TOP; Part Description: Triple 3mm LEDs, Red Top, Yellow Mid, Green Bot, PCB Edge Mounting; Manufacturer: MENTOR; PressFit: No; Bonding: No; Part Number: LED_MENTOR_1882.2781; Component Kind: Standard; Component Type: Standard; Color: Red/Yellow/Green; PackageDescription: 3x LED 3mm (Red+Yellow +Green) PCB Edge Mounting MENTOR 1882.2781; Manufacturer Part Number: 1882.2781; Pin Count: 6; Mounted: Yes; Socket: No; SMD: No; Sense: No; ComponentHeight: 12mm; HelpURL: \\cern.ch\dfs\Applications\Altium\Datasheets\LED_MENTOR_1882.2781.pdf; Author: CERN DEM JLC; CreateDate: 03.02.2009; LatestRevisionDate: 17.03.2010
R13-R36 = R0603_330R_1%_0.1W_100PPM: Resistor - 1%; Part Description: General Purpose Thick Film Chip Resistor; Manufacturer: GENERIC; Manufacturer1 Part Number: NRC06F3300TRF; Power: 0.1W; TC: ±100ppm/°C; Table: Resistors SMD; Part Number: R0603_330R_1%_0.1W_100PPM; Component Kind: Standard; Component Type: Standard; Pin Count: 2; Value: 330; Status: Preferred; Tolerance: ±1%; Manufacturer Part Number: R0603_330R_1%_0.1W_100PPM; Case: 0603; Mounted: Yes; Socket: No; SMD: Yes; Manufacturer1 Example: NIC COMPONENT; Manufacturer1 ComponentHeight: 0.55mm; HelpURL: \\cern.ch\dfs\Applications\Altium\Datasheets\R0603_NIC_NRC.pdf; Author: CERN DEM JLC; CreateDate: 2007-12-03; LatestRevisionDate: 2008-03-13

## Nets that join several sheets
GND: Booster_USER_IFC_W5500 (25 pins), ETH_IFC (23 pins), LEDs (30 pins)
P3V3: Booster_USER_IFC_W5500 (J4.21 J4.22 SW1.2), ETH_IFC (8 pins), LEDs (9 pins)
INT: Booster_USER_IFC_W5500 (J4.12), ETH_IFC (IC1.36)
LED_CS: Booster_USER_IFC_W5500 (J4.14), LEDs (IC3.12 IC4.12 IC5.12)
LED_OEn: Booster_USER_IFC_W5500 (J4.18), LEDs (IC3.13 IC4.13 IC5.13)
LED_SCK: Booster_USER_IFC_W5500 (J4.16), LEDs (IC3.11 IC4.11 IC5.11)
LED_SDI: Booster_USER_IFC_W5500 (J4.17), LEDs (IC3.14)
RESETn: Booster_USER_IFC_W5500 (J4.10), ETH_IFC (IC1.37)
SPI1_MISO: Booster_USER_IFC_W5500 (J4.8), ETH_IFC (IC1.34)
SPI1_MOSI: Booster_USER_IFC_W5500 (J4.6), ETH_IFC (IC1.35)
SPI1_NSS: Booster_USER_IFC_W5500 (J4.2), ETH_IFC (IC1.32)
SPI1_SCK: Booster_USER_IFC_W5500 (J4.4), ETH_IFC (IC1.33)